# Altium schematic sheet main.SchDoc
size A4
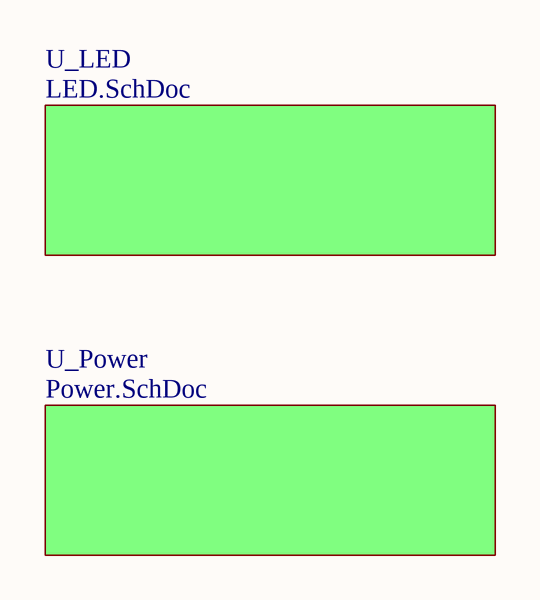
[diagram p0: main.SchDoc]

## Sub-sheets
U_LED = LED.SchDoc: no entries
U_Power = Power.SchDoc: no entries